# Altium schematic sheet COVER PAGE.SchDoc
size A3; Date: 12/09/2026; Author: J. Villodres; DrawnBy: Juan Alejandro Villodres Perdomo; DocumentNumber: 1; Revision: 0.1; SheetNumber: 1; SheetTotal: 4; ProjectDescription: Development board with custom ESP32-C3 SoC and no RF shielding.; github: https://github.com/jvillodres/pcb-designs
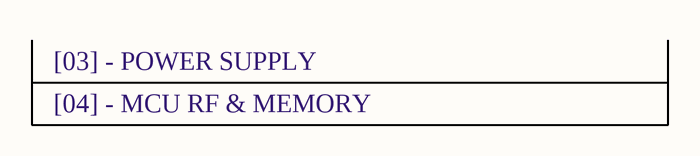
[diagram p0: COVER PAGE.SchDoc]

## Notes on the sheet
- [03] - POWER SUPPLY
- [04] - MCU RF & MEMORY
- Designator Format (XPNN):
- DESIGN CONSIDERATIONS:
- TABLE OF CONTENTS:
- X: Standard Designator
- P: Page Number
- N: Device Number
- Sheet Name:
- More Projects <https://github.com/jvillodres/pcb-designs>
- [01] - COVER PAGE
- [02] - BLOCK DIAGRAM
- Project Name:
- Sheet Title:
- Project Description:
- Doc. num:
- Designer:
- Date initialized:
- Last modified:
- Version:
- Size:
- A3
- Sheet:
- Of